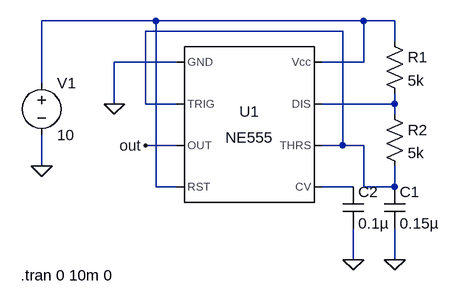
[diagram p0: schematic 555_timer_10V.asc]
555_timer_10V.asc, the LTspice schematic file:
Version 4
SHEET 1 880 680
WIRE 48 32 -128 32
WIRE 368 32 48 32
WIRE 416 32 368 32
WIRE 336 48 32 48
WIRE 416 64 416 32
WIRE 80 96 -16 96
WIRE 368 96 368 32
WIRE 368 96 304 96
WIRE -128 128 -128 32
WIRE -16 160 -16 96
WIRE 32 160 32 48
WIRE 80 160 32 160
WIRE 416 160 416 144
WIRE 416 160 304 160
WIRE 416 176 416 160
WIRE 80 224 32 224
WIRE 336 224 336 48
WIRE 336 224 304 224
WIRE 368 224 336 224
WIRE -128 256 -128 208
WIRE 48 288 48 32
WIRE 80 288 48 288
WIRE 352 288 304 288
WIRE 368 288 368 224
WIRE 416 288 416 256
WIRE 416 288 368 288
WIRE 352 400 352 352
WIRE 416 400 416 352
FLAG -16 160 0
FLAG 32 224 out
FLAG 416 400 0
FLAG -128 256 0
FLAG 352 400 0
SYMBOL res 400 48 R0
SYMATTR InstName R1
SYMATTR Value 5k
SYMBOL res 400 160 R0
SYMATTR InstName R2
SYMATTR Value 5k
SYMBOL voltage -128 112 R0
WINDOW 123 0 0 Left 0
WINDOW 39 0 0 Left 0
SYMATTR InstName V1
SYMATTR Value 10
SYMBOL cap 400 288 R0
SYMATTR InstName C1
SYMATTR Value 0.15µ
SYMBOL Misc\\NE555 192 192 R0
SYMATTR InstName U1
SYMBOL cap 336 288 R0
SYMATTR InstName C2
SYMATTR Value 0.1µ
TEXT -160 424 Left 2 !.tran 0 10m 0

The netlist it stands for:
* 555_timer_10V.asc
R1 N001 N003 5k
R2 N003 N002 5k
V1 N001 0 10
C1 N002 0 0.15µ
XU1 0 N002 out N001 N004 N002 N003 N001 NE555  ; pins GND TRIG OUT RST CV THRS DIS Vcc
C2 N004 0 0.1µ
.tran 0 10m 0
.lib NE555.sub
.backanno
.end